# EAGLE design Flight diagram (EAGLE 9.6.2)
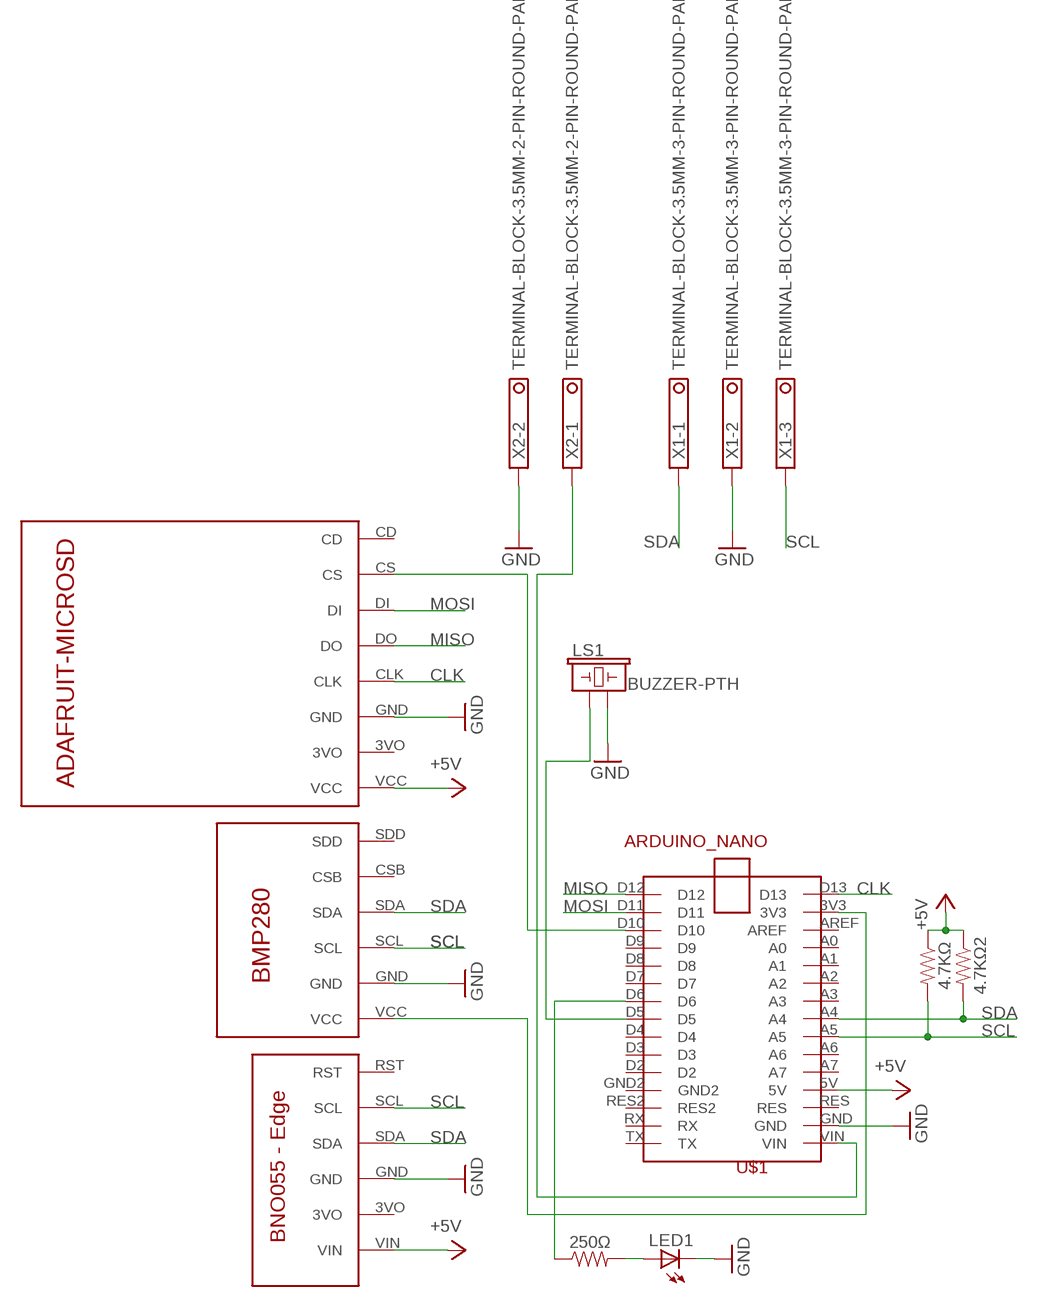
[diagram p0: schematic, sheet 1]

## Parts
4.7KΩ  RESISTORAXIAL-0.3  [AXIAL-0.3]
4.7KΩ2  RESISTORAXIAL-0.3  [AXIAL-0.3]
250Ω  RESISTORAXIAL-0.3  [AXIAL-0.3]
LED1  LED5MM  [LED5MM]
LS1  BUZZER-PTH  [BUZZER-12MM]
U$1  ARDUINO_NANO  [ARDUIN_NANO]
U$2  BNO055  [BNO055]
U$3  ADAFRUIT-MICROSD  [ADAFRUIT-MICROSD]
U$4  BMP280  [BMP280]
X1  TERMINAL-BLOCK-3.5MM-3-PIN-ROUND-PAD  [TERMINAL-BLOCK-3-PIN-3.5MM-ROUND-PAD]
X2  TERMINAL-BLOCK-3.5MM-2-PIN-ROUND-PAD  [TERMINAL-BLOCK-2-PIN-3.5MM-ROUND-PAD]

## Nets
+5V: 4.7KΩ2.P$1 4.7KΩ.P$1 U$1.5V U$2.VIN U$3.VCC
CLK: U$1.D13 U$3.CLK
GND: LED1.K(C) LS1.- U$1.GND U$2.GND U$3.GND U$4.GND X1.2 X2.2
MISO: U$1.D12 U$3.DO
MOSI: U$1.D11 U$3.DI
N$1: 250Ω.P$2 LED1.A
N$2: U$1.3V3 U$4.VCC
N$3: U$1.VIN X2.1
N$4: 250Ω.P$1 U$1.D6
N$8: U$1.D10 U$3.CS
N$9: LS1.+ U$1.D5
SCL: 4.7KΩ.P$2 U$1.A5 U$2.SCL U$4.SCL X1.3
SDA: 4.7KΩ2.P$2 U$1.A4 U$2.SDA U$4.SDA X1.1
Unconnected: U$1.A0 U$1.A1 U$1.A2 U$1.A3 U$1.A6 U$1.A7 U$1.AREF U$1.D2 U$1.D3 U$1.D4 U$1.D7 U$1.D8 U$1.D9 U$1.GND2 U$1.RES U$1.RES2 U$1.RX U$1.TX U$2.3VO U$2.RST U$3.3VO U$3.CD U$4.CSB U$4.SDD

## Library data of the parts
4.7KΩ 4.7KΩ2 250Ω = SparkFun-Resistors:RESISTOR: Generic Resistor Package
LED1 = adafruit:LED: LED OSRAM: - CHIPLED LG R971, LG N971, LY N971, LG Q971, LY Q971, LO R971, LY R971 LH N974, LH R974 LS Q976, LO Q976, LY Q976 LO Q996 - Hyper CHIPLED LW Q18S LB Q993, LB Q99A, LB R99A - SideLED LS A670, LO A670, LY A670, LG A670, LP A670 LB A673, LV A673, LT A673, LW A673 LH A674 LY A675 LS A676, LA A676, LO A676, LY A676, LW A676 LS A679, LY A679, LG A679 - Hyper Micro SIDELED® LS Y876, LA Y876, LO Y876, LY Y876 LT Y87S - SmartLED LW L88C, LW L88S LB L89C, LB L89S, LG L890 LS L89K, LO L89K, LY L89K LS L896, LA L896, LO L896, LY L896 - TOPLED LS T670, LO T670, LY T670, LG T670, LP T670 LSG T670, LSP T670, LSY T670, LOP T670, LYG T670 LG T671, LOG T671, LSG T671 LB T673, LV T673, LT T673, LW T673 LH T674 LS T676, LA T676, LO T676, LY T676, LB T676, LH T676, LSB T676, LW T676 LB T67C, LV T67C, LT T67C, LS T67K, LO T67K, LY T67K, LW E67C LS E67B, LA E67B, LO E67B, LY E67B, LB E67C, LV E67C, LT E67C LW T67C LS T679, LY T679, LG T679 LS T770, LO T770, LY T770, LG T770, LP T770 LB T773, LV T773, LT T773, LW T773 LH T774 LS E675, LA E675, LY E675, LS T675 LS T776, LA T776, LO T776, LY T776, LB T776 LHGB T686 LT T68C, LB T68C - Hyper Mini TOPLED® LB M676 - Mini TOPLED Santana® LG M470 LS M47K, LO M47K, LY M47K Source: http://www.osram.convergy.de/
LS1 = SparkFun-Electromechanical new:BUZZER: Buzzer Small round buzzers that operate around the audible 2kHz range. You can use these as speakers to create simple music or user interfaces. Variant Overview: PTH - Mini Speaker - PC Mount 12mm 2.048kHz <https://www.sparkfun.com/products/7950> PTH_KIT - Mini Speaker - PC Mount 12mm 2.048kHz <https://www.sparkfun.com/products/7950> KIT simplifies soldering by adding stop mask to one side of the pads. PTH_NO_SILK - Mini Speaker - PC Mount 12mm 2.048kHz <https://www.sparkfun.com/products/7950> No silkscreen indicator of buzzer outline. PTH_KIT_NO_SILK - Mini Speaker - PC Mount 12mm 2.048kHz <https://www.sparkfun.com/products/7950> KIT package w/o silkscreen SMD - Buzzer Audio Magnetic (CCV-084B16) SMD buzzer used on, e.g. the LilyPad Buzzer <https://www.sparkfun.com/products/8463> and RFID USB Reader <https://www.sparkfun.com/products/9963>. SMD_KIT - Buzzer Audio Magnetic (CCV-084B16) SMD Buzzer with elongated pins to make soldering easier. Used on the SparkFun Simon Says - Surface Mount Soldering Kit <https://www.sparkfun.com/products/10935>.; PROD_ID: COMP-08253; SF_SKU: COM-07950
U$1 = Arduino:ARDUINO_NANO
U$2 = BNO055 short:BNO055
U$3 = ADAFRUIT-MICROSD:ADAFRUIT-MICROSD
U$4 = BMP280:BMP280
X1 = Rembrandt Electronics - Terminal Block 3-5mm v1-0:TERMINAL-BLOCK-3.5MM-3-PIN: Terminal Block 3.5mm Pitch: 3,5 mm Number of pins: 3 Created by Rembrandt Electronics www.rembrandtelectronics.com
X2 = Rembrandt Electronics - Terminal Block 3-5mm v1-0:TERMINAL-BLOCK-3.5MM-2-PIN: Terminal Block 3.5mm Pitch: 3,5 mm Number of pins: 2 Created by Rembrandt Electronics www.rembrandtelectronics.com

## Board
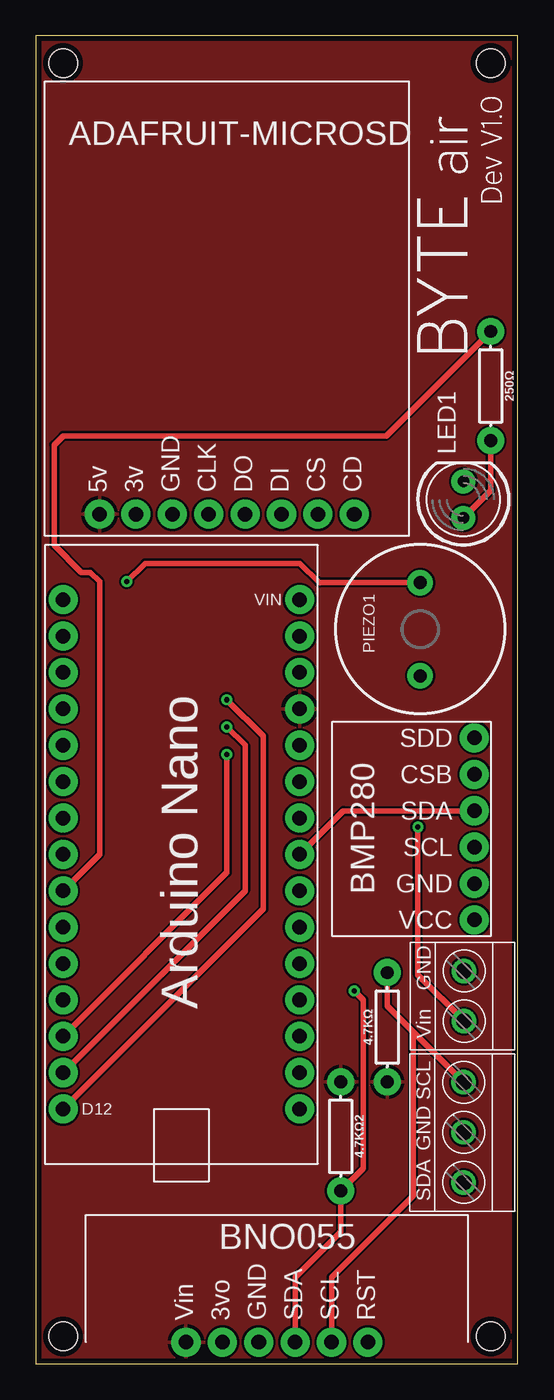
[diagram p1: board, top side]
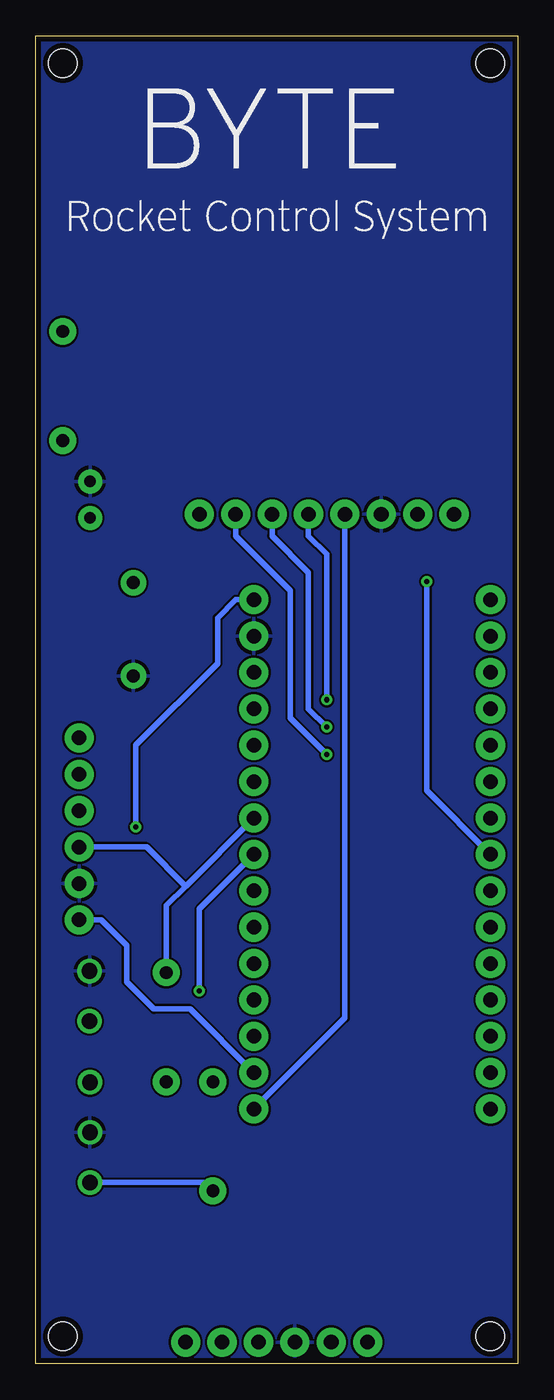
[diagram p2: board, bottom side, seen from below]

Size 33.63 x 92.71 mm. Coordinates in mm from the lower left corner, seen from the top.
Outline: 0,0 33.63,0 33.63,92.71 0,92.71 0,0
Copper layers (1*16): Top 0.035559375mm / dielectric 60mil / Bottom 0.035559375mm
Design rules "default *": minimum track width 6mil, minimum drill 0.35mm, track to track 6mil, track to pad 6mil, pad to pad 6mil, via to via 6mil, smd to smd 6mil, copper to edge 15mil, drill to drill 6mil, minimum pad ring 10mil, minimum via ring 8mil, stop-mask expansion 4mil, vias tented up to drill 0mil, thermal gap 10mil
Holes 2 mm at 1.91,1.91 31.75,1.91 31.75,90.81 1.91,90.81

### Footprints (pad centres in the part's own frame; a part is rotated, then mirrored left to right if it is on the bottom)
AXIAL-0.3 = drill 0.9 pad 1.88: P$1 -3.81,0; P$2 3.81,0
LED5MM = drill 0.813 pad 1.676: A -1.27,0; K 1.27,0
BUZZER-12MM = drill 0.9 pad 1.778: + 3.25,0; - -3.25,0
ARDUIN_NANO = drill 1.016 pad 2.032: 3V3 3.81,8.89; 5V 3.81,34.29; A0 3.81,13.97; A1 3.81,16.51; A2 3.81,19.05; A3 3.81,21.59; A4 3.81,24.13; A5 3.81,26.67; A6 3.81,29.21; A7 3.81,31.75; AREF 3.81,11.43; D2 -12.7,31.75; D3 -12.7,29.21; D4 -12.7,26.67; D5 -12.7,24.13; D6 -12.7,21.59; D7 -12.7,19.05; D8 -12.7,16.51; D9 -12.7,13.97; D10 -12.7,11.43; D11 -12.7,8.89; D12 -12.7,6.35; D13 3.81,6.35; GND 3.81,39.37; GND2 -12.7,34.29; RES 3.81,36.83; RES2 -12.7,36.83; RX -12.7,39.37; TX -12.7,41.91; VIN 3.81,41.91
BNO055 = drill 1.016 pad 2.032: 3VO 9.525,1.27; GND 12.065,1.27; RST 19.685,1.27; SCL 17.145,1.27; SDA 14.605,1.27; VIN 6.985,1.27
ADAFRUIT-MICROSD = drill 1.016 pad 2.032: 3VO 6.35,1.524; CD 21.59,1.524; CLK 11.43,1.524; CS 19.05,1.524; DI 16.51,1.524; DO 13.97,1.524; GND 8.89,1.524; VCC 3.81,1.524
BMP280 = drill 1.016 pad 2.032: CSB 11.303,1.143; GND 3.683,1.143; SCL 6.223,1.143; SDA 8.763,1.143; SDD 13.843,1.143; VCC 1.143,1.143
TERMINAL-BLOCK-3-PIN-3.5MM-ROUND-PAD = drill 1.1 pad 1.7: 1 -3.5,-0.1; 2 0,-0.1; 3 3.5,-0.1
TERMINAL-BLOCK-2-PIN-3.5MM-ROUND-PAD = drill 1.1 pad 1.7: 1 -1.75,-0.1; 2 1.75,-0.1

### Placement (x,y rotation side)
4.7KΩ  24.53,23.5 90 top
4.7KΩ2  21.27,15.88 270 top
250Ω  31.75,68.26 270 top
LED1  29.84,60.33 90 top
LS1  26.83,51.28 90 top
U$1  14.61,11.43 0 top
U$2  3.49,0.23 0 top
U$3  0.64,57.78 0 top
U$4  31.75,29.84 90 top
X1  29.76,16.15 90 top
X2  29.78,25.67 90 top

### Tracks (layer width: path | path; a pad name or v marks a point on that pad's centre or on a via)
+5V
  pour Top: -3.81,93.34 -3.81,-2.54 34.92,-2.54 34.92,93.34
CLK
  Bottom 0.381: U$3.CLK 12.06,24.13 U$1.D13
GND
  pour Bottom: -5.08,93.98 -5.08,-4.45 36.2,-4.45 36.2,93.98
MISO  (via drill 0.35)
  Top 0.381: v13.34,46.35 15.88,43.81 15.88,31.75 U$1.D12
  Bottom 0.381: U$3.DO 14.61,57.78 13.34,56.52 v13.34,46.35
MOSI  (via drill 0.35)
  Top 0.381: v13.34,44.45 14.61,43.18 14.61,33.02 U$1.D11
  Bottom 0.381: U$3.DI 17.14,57.78 14.61,55.24 14.61,45.72 v13.34,44.45
N$1
  Top 0.381: LED1.A 31.75,60.96 250Ω.P$2
N$2
  Bottom 0.381: U$1.3V3 22.86,24.77 25.4,24.77 27.3,26.67 27.3,29.21 29.08,30.99 U$4.VCC
N$3  (via drill 0.35)
  Top 0.381: X2.1 26.67,27.13 v26.67,37.47
  Bottom 0.381: v26.67,37.47 26.67,43.18 20.95,48.9 20.95,52.07 19.68,53.34 U$1.VIN
N$4
  Top 0.381: 250Ω.P$1 24.45,64.77 1.91,64.77 1.27,64.14 1.27,57.15 3.17,55.24 3.81,55.24 4.45,54.61 4.45,35.56 U$1.D6
N$8  (via drill 0.35)
  Top 0.381: v13.34,42.55 13.34,34.29 U$1.D10
  Bottom 0.381: U$3.CS 19.68,57.78 15.88,53.98 15.88,45.09 v13.34,42.55
N$9  (via drill 0.35)
  Top 0.381: LS1.+ 19.77,54.53 18.41,55.88 7.62,55.88 v6.35,54.61
  Bottom 0.381: v6.35,54.61 6.35,40.01 U$1.D5
SCL
  Top 0.381: X1.3 26.34,23.17 | 26.34,23.17 24.53,24.98 4.7KΩ.P$2 | U$2.SCL 20.64,6.03 26.34,11.74 26.34,23.17
  Bottom 0.381: U$1.A5 23.18,33.34 | 23.18,33.34 24.53,31.99 4.7KΩ.P$2 | 23.18,33.34 25.91,36.07 U$4.SCL
SDA  (via drill 0.35)
  Top 0.381: v22.23,26.04 22.86,25.4 22.86,13.65 4.7KΩ2.P$2 21.27,9.21 18.1,6.03 U$2.SDA | U$1.A4 21.46,38.61 U$4.SDA
  Bottom 0.381: U$1.A4 22.23,31.75 v22.23,26.04 | X1.1 21.86,12.65 4.7KΩ2.P$2

### Text on the board
tPlace: VIN | PIEZO1 | D12